# Altium schematic sheet Motordriver.SchDoc
size A4
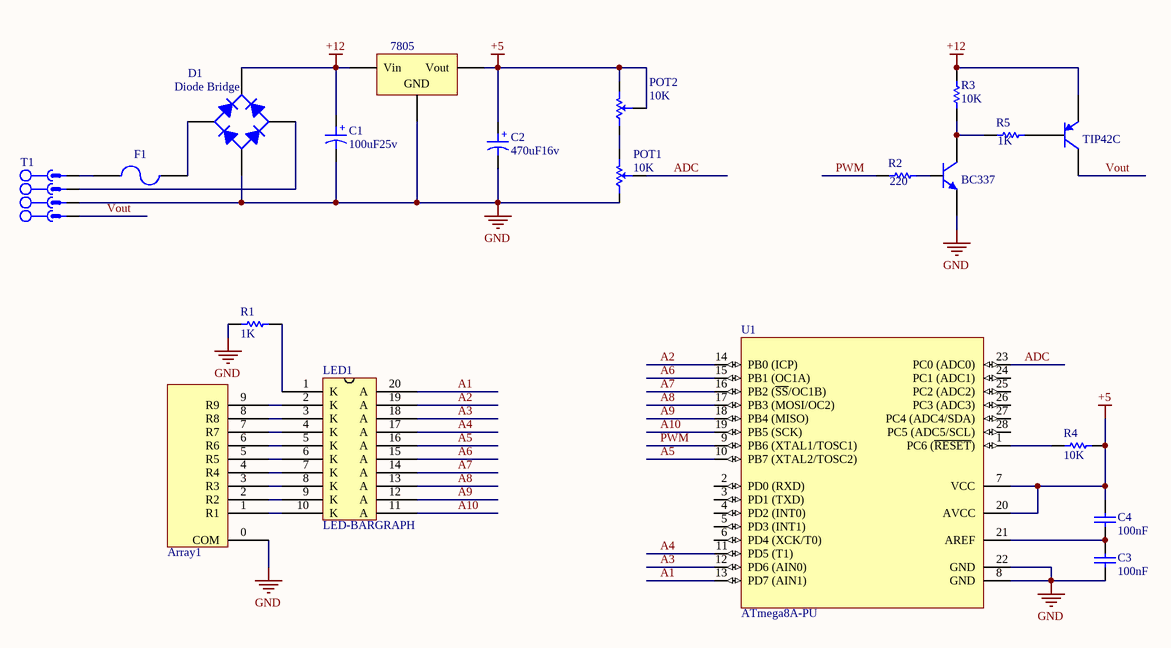
[diagram p0: Motordriver.SchDoc]

## Parts
7805  L7805CV  [TO-220 AB WITH HEAT SINK]  (value not drawn)
Array1  Array10pin  [Array]  (value not drawn)
BC337  TIP41C  [TO-220 AB WITH HEAT SINK]  (value not drawn)
C1  100uF25v  [Cap electrolitic radial 6x7-2.5]
C2  470uF16v  [Cap electrolitic radial 6x7-2.5]
C3  100nF  [CAP Ceramic 2.5MM]
C4  100nF  [CAP Ceramic 2.5MM]
D1  Diode Bridge  [Bridge Circle Package]
F1  F=1.0 A  [Fuse 5x20 With holder pin]  (value not drawn)
LED1  LED-BARGRAPH  [LED-BARGRAPH]
POT1  10K  [POT]
POT2  10K  [POT 4]
R1  1K  [Axial 0_5W 5_0mm]
R2  220  [Axial 0_5W 5_0mm]
R3  10K  [Axial 0_5W 5_0mm]
R4  10K  [Axial 0_5W 5_0mm]
R5  1K  [Axial 0_5W 5_0mm]
T1  (no value)  [MSTBV 2,5/4-G-5]
TIP42C  TIP42C  [TO-220 AB WITH HEAT SINK]  (value not drawn)
U1  ATmega8A-PU  [28P3]

## Nets
+5: 7805.3(Vout) C2.1 C4.2 POT2.2(CW) POT2.3(SetPoint) R4.2 U1.7(VCC) U1.20(AVCC)
+12: 7805.1(Vin) C1.1 D1.1(+) R3.2 TIP42C.3(E)
GND: 7805.2(GND) Array1.0(COM) BC337.3(E) C1.2 C2.2 C3.2 D1.4(-) POT1.1(CCW) R1.1 T1.3 U1.8(GND) U1.22(GND)
A1: LED1.20(A) U1.13(PD7_(AIN1))
A2: LED1.19(A) U1.14(PB0_(ICP))
A3: LED1.18(A) U1.12(PD6_(AIN0))
A4: LED1.17(A) U1.11(PD5_(T1))
A5: LED1.16(A) U1.10(PB7_(XTAL2/TOSC2))
A6: LED1.15(A) U1.15(PB1_(OC1A))
A7: LED1.14(A) U1.16(PB2_(~{SS}/OC1B))
A8: LED1.13(A) U1.17(PB3_(MOSI/OC2))
A9: LED1.12(A) U1.18(PB4_(MISO))
A10: LED1.11(A) U1.19(PB5_(SCK))
ADC: POT1.3(SetPoint) U1.23(PC0_(ADC0))
PWM: R2.1 U1.9(PB6_(XTAL1/TOSC1))
Vout: T1.4 TIP42C.2(C)
NetArray1_1: Array1.1(R1) LED1.10(K)
NetArray1_2: Array1.2(R2) LED1.9(K)
NetArray1_3: Array1.3(R3) LED1.8(K)
NetArray1_4: Array1.4(R4) LED1.7(K)
NetArray1_5: Array1.5(R5) LED1.6(K)
NetArray1_6: Array1.6(R6) LED1.5(K)
NetArray1_7: Array1.7(R7) LED1.4(K)
NetArray1_8: Array1.8(R8) LED1.3(K)
NetArray1_9: Array1.9(R9) LED1.2(K)
NetBC337_1: BC337.1(B) R2.2
NetBC337_2: BC337.2(C) R3.1 R5.1
NetC3_1: C3.1 C4.1 U1.21(AREF)
NetD1_2: D1.2(AC) F1.2
NetD1_3: D1.3(AC) T1.2
NetF1_1: F1.1 T1.1
NetLED1_1: LED1.1(K) R1.2
NetPOT1_2: POT1.2(CW) POT2.1(CCW)
NetR4_1: R4.1 U1.1(PC6_(~{RESET}))
NetR5_2: R5.2 TIP42C.1(B)

Not connected (* = marked no-connect by the designer): U1 2(PD0_(RXD)) 3(PD1_(TXD)) 4(PD2_(INT0)) 5(PD3_(INT1)) 6(PD4_(XCK/T0)) 24(PC1_(ADC1)) 25(PC2_(ADC2)) 26(PC3_(ADC3)) 27(PC4_(ADC4/SDA)) 28(PC5_(ADC5/SCL))

## Notes on the sheet
- (in symbol Cap ELECTROLITIC TOTAL SIZE) +

## Library data of the parts
7805 = L7805CV-Linear Voltage Regulator: Linear Voltage Regulator IC Positive FIXED Output 5V 1.5A TO-220AB; Manufacturer: STMicroelectronics; Designer: Abbas Basereh; Link: https://www.aliexpress.com/item/; Link: http://www.tme.eu/en/; Link: http://www.digikey.com/; Part. No: L7805CV
BC337 = TIP41C: NPN  power transistor; Manufacturer: STMicroelectronics; Designer: Abbas Basereh; DESC.: Complementary power transistors; Link: https://www.aliexpress.com/item/; Link: http://www.tme.eu/en/; Link: http://www.digikey.com/; Part. No: TIP41C
C1 C2 = Cap ELECTROLITIC TOTAL SIZE: Cap electrolitic radial; Designer: Abbas Basereh; Data: 16-12-2016; Part. No: *
  C1: VALUE: 100uF25v
  C2: VALUE: 470uF16v
C3 C4 = CAP CERAMIC TOTAL SIZE: CAP Ceramic Total; Designer: Ali Hafizi
D1 = Diode Bridge TOTAL SIZE: Full Wave Diode Bridge; Designer: Abbas Basereh; Design Date: 1395/11/09; ComponentLink1Description: Datasheet; ComponentLink2Description: Reference; Mounting Technology: Surface Mount\Through-Hole; Status: Unreleased
F1 = Fuse 5x20 with holdeer pins: Fuses 5x20; Designer: Abbas Basereh; Desc.: fuse with holder pins 5x20; Data: 28-12-2016
POT1 POT2 = POT: Variable Resistor; Value: 10K
R1-R5 = RES Axial 0.5W: Designer: Abbas Basereh; Desc.: RES Axial 0.5W; Data: 4-1-2017
T1 = CON_Phoenix_MSTBV_04: 4 Pitch: 5 mm Color: green Contact surface: Tin Assembly; Manufacturer: PHOENIX CONTACT; Connector type: PCB Terminal Block; designer: ABBAS BASEREH; Max Current: 12 A; Positions: 4; Voltage: 320 V; Category: Connector; ComponentLink1Description: Header, Nominal current: 12 A Rated voltage (III/2): 320 V Number of positions: 4 Pitch: 5 mm Color: green Contact surface: Tin Assembly: Soldering  DESIGNER:ABBAS BASEREH; ComponentLink2Description: Reference; Mounting Technology: Through-Hole; Pin Count: 4; Revision 1: 2017-3-1; Status: Unreleased; PART.NO: PHOENIX
TIP42C = TIP42C: PNP  power transistor; Manufacturer: STMicroelectronics; Designer: Abbas Basereh; DESC.: Complementary power transistors; Link: https://www.aliexpress.com/item/; Link: http://www.tme.eu/en/; Link: http://www.digikey.com/; Part. No: TIP42C
U1 = ATmega8A-PU: 8-bit AVR Microcontroller, 8KB Flash, 512 Bytes EEPROM, 1KB SRAM, 28-pin PDIP, Industrial Grade (-40°C to 85°C); Published: 2017-1-5; DatasheetVersion: 2017-1-5; PackageVersion: 2017-1-5; PackageReference: 28P3; Publisher: Abbas Basereh; PackageDescription: 28-lead (0.300"/7.62mm Wide) Plastic Dual Inline Package (PDIP); Supplier 1: Digi-Key; Supplier Part Number 1: ATMEGA8A-PU-ND; Supplier 2: Farnell; Supplier Part Number 2: 1748534; Supplier 3: Mouser; Supplier Part Number 3: 556-ATMEGA8A-PU; ComponentLink1Description: Manufacturer Link; ComponentLink1URL: http://www.atmel.com/products/avr/default.asp?; ComponentLink2Description: ATmega8A Datasheet; ComponentLink2URL: http://www.atmel.com/dyn/resources/prod_documents/doc8159.pdf; ComponentLink3Description: ATmega8A Summary; ComponentLink3URL: http://www.atmel.com/dyn/resources/prod_documents/8159S.pdf; ComponentLink4Description: Atmel.com Home; ComponentLink4URL: http://www.atmel.com